# Altium schematic sheet tcrt_1.SchDoc
size A4
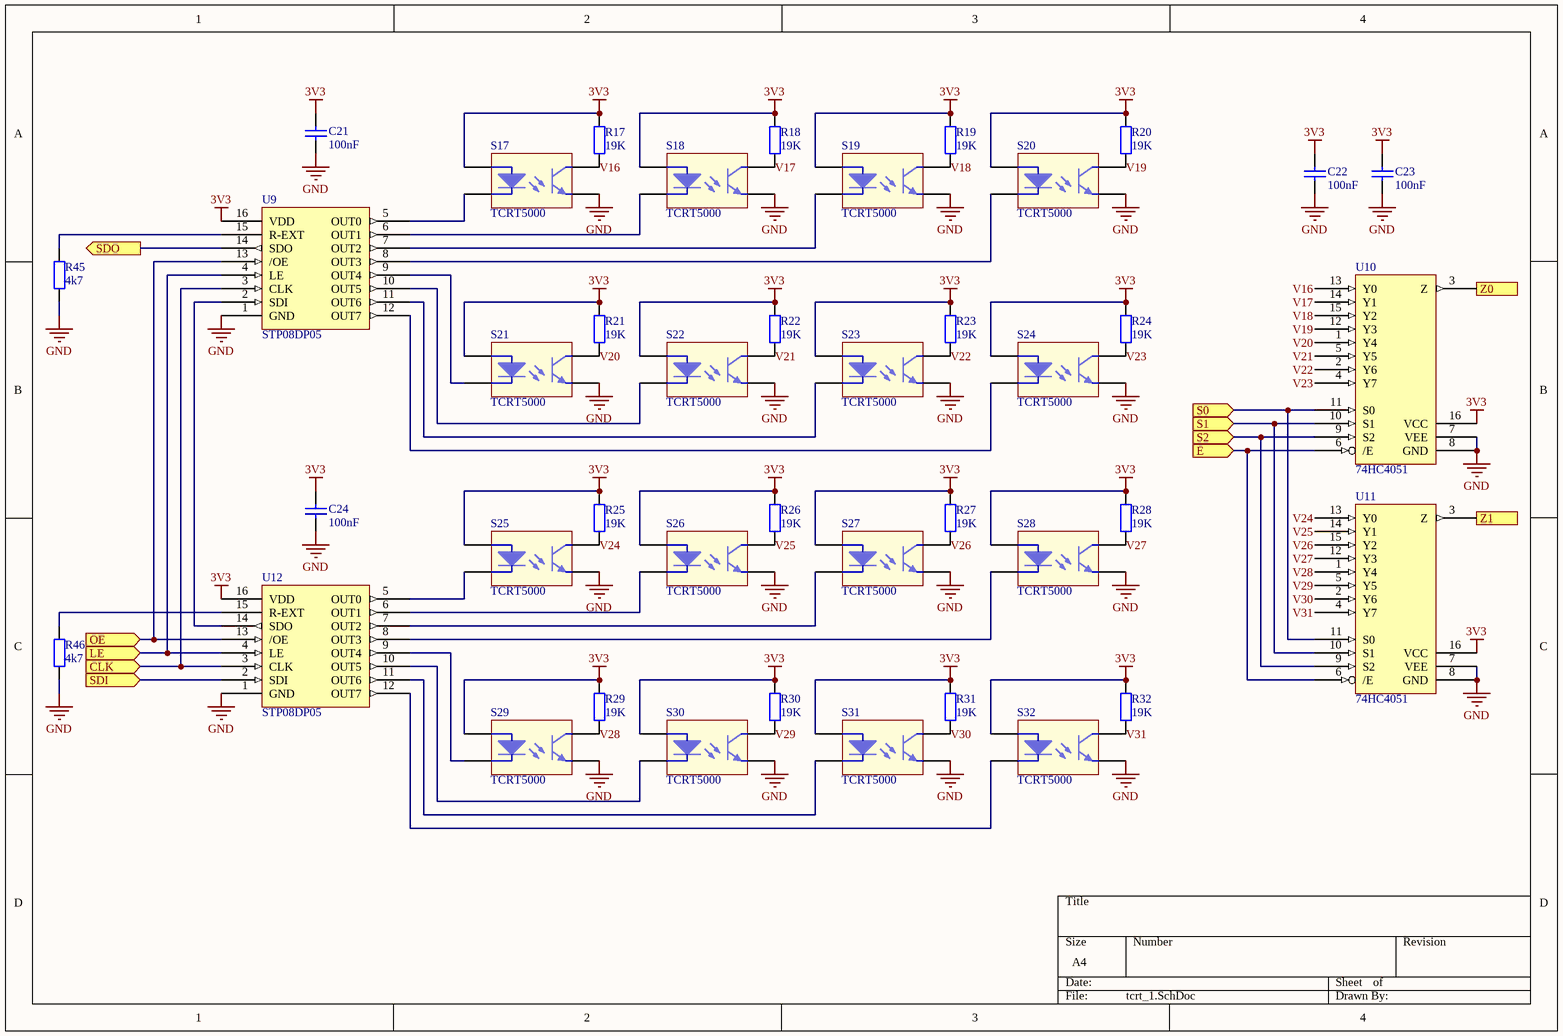
[diagram p0: tcrt_1.SchDoc]

## Parts
C21  100nF  [FP_0805_CAP_085]
C22  100nF  [FP_0805_CAP_085]
C23  100nF  [FP_0805_CAP_085]
C24  100nF  [FP_0805_CAP_085]
R17  19K  [FP_0805_RES]
R18  19K  [FP_0805_RES]
R19  19K  [FP_0805_RES]
R20  19K  [FP_0805_RES]
R21  19K  [FP_0805_RES]
R22  19K  [FP_0805_RES]
R23  19K  [FP_0805_RES]
R24  19K  [FP_0805_RES]
R25  19K  [FP_0805_RES]
R26  19K  [FP_0805_RES]
R27  19K  [FP_0805_RES]
R28  19K  [FP_0805_RES]
R29  19K  [FP_0805_RES]
R30  19K  [FP_0805_RES]
R31  19K  [FP_0805_RES]
R32  19K  [FP_0805_RES]
R45  4k7  [FP_0805_RES]
R46  4k7  [FP_0805_RES]
S17  TCRT5000  [TCRT5000_nohole]
S18  TCRT5000  [TCRT5000_nohole]
S19  TCRT5000  [TCRT5000_nohole]
S20  TCRT5000  [TCRT5000_nohole]
S21  TCRT5000  [TCRT5000_nohole]
S22  TCRT5000  [TCRT5000_nohole]
S23  TCRT5000  [TCRT5000_nohole]
S24  TCRT5000  [TCRT5000_nohole]
S25  TCRT5000  [TCRT5000_nohole]
S26  TCRT5000  [TCRT5000_nohole]
S27  TCRT5000  [TCRT5000_nohole]
S28  TCRT5000  [TCRT5000_nohole]
S29  TCRT5000  [TCRT5000_nohole]
S30  TCRT5000  [TCRT5000_nohole]
S31  TCRT5000  [TCRT5000_nohole]
S32  TCRT5000  [TCRT5000_nohole]
U9  STP08DP05  [TSSOP16_2]
U10  74HC4051  [TSSOP16_2]
U11  74HC4051  [TSSOP16_2]
U12  STP08DP05  [TSSOP16_2]

## Ports
CLK (in), E (in), LE (in), OE (in), S0 (in), S1 (in), S2 (in), SDI (in), SDO (out), Z0 (out), Z1 (out)

## Nets
3V3: C21.2 C22.2 C23.2 C24.2 R17.2 R18.2 R19.2 R20.2 R21.2 R22.2 R23.2 R24.2 R25.2 R26.2 R27.2 R28.2 R29.2 R30.2 R31.2 R32.2 S17.A S18.A S19.A S20.A S21.A S22.A S23.A S24.A S25.A S26.A S27.A S28.A S29.A S30.A S31.A S32.A U9.16(VDD) U10.16(VCC) U11.16(VCC) U12.16(VDD)
GND: C21.1 C22.1 C23.1 C24.1 R45.2 R46.2 S17.E S18.E S19.E S20.E S21.E S22.E S23.E S24.E S25.E S26.E S27.E S28.E S29.E S30.E S31.E S32.E U9.1(GND) U10.7(VEE) U10.8(GND) U11.7(VEE) U11.8(GND) U12.1(GND)
CLK: U9.3(CLK) U12.3(CLK) ; port CLK
E: U10.6(/E) U11.6(/E) ; port E
LE: U9.4(LE) U12.4(LE) ; port LE
OE: U9.13(/OE) U12.13(/OE) ; port OE
S0: U10.11(S0) U11.11(S0) ; port S0
S1: U10.10(S1) U11.10(S1) ; port S1
S2: U10.9(S2) U11.9(S2) ; port S2
SDI: U12.2(SDI) ; port SDI
SDO: U9.14(SDO) ; port SDO
V16: R17.1 S17.Coll(C) U10.13(Y0)
V17: R18.1 S18.Coll(C) U10.14(Y1)
V18: R19.1 S19.Coll(C) U10.15(Y2)
V19: R20.1 S20.Coll(C) U10.12(Y3)
V20: R21.1 S21.Coll(C) U10.1(Y4)
V21: R22.1 S22.Coll(C) U10.5(Y5)
V22: R23.1 S23.Coll(C) U10.2(Y6)
V23: R24.1 S24.Coll(C) U10.4(Y7)
V24: R25.1 S25.Coll(C) U11.13(Y0)
V25: R26.1 S26.Coll(C) U11.14(Y1)
V26: R27.1 S27.Coll(C) U11.15(Y2)
V27: R28.1 S28.Coll(C) U11.12(Y3)
V28: R29.1 S29.Coll(C) U11.1(Y4)
V29: R30.1 S30.Coll(C) U11.5(Y5)
V30: R31.1 S31.Coll(C) U11.2(Y6)
V31: R32.1 S32.Coll(C) U11.4(Y7)
Z0: U10.3(Z) ; port Z0
Z1: U11.3(Z) ; port Z1
NetR45_1: R45.1 U9.15(R-EXT)
NetR46_1: R46.1 U12.15(R-EXT)
NetS17_Cath: S17.Cath(K) U9.5(OUT0)
NetS18_Cath: S18.Cath(K) U9.6(OUT1)
NetS19_Cath: S19.Cath(K) U9.7(OUT2)
NetS20_Cath: S20.Cath(K) U9.8(OUT3)
NetS21_Cath: S21.Cath(K) U9.9(OUT4)
NetS22_Cath: S22.Cath(K) U9.10(OUT5)
NetS23_Cath: S23.Cath(K) U9.11(OUT6)
NetS24_Cath: S24.Cath(K) U9.12(OUT7)
NetS25_Cath: S25.Cath(K) U12.5(OUT0)
NetS26_Cath: S26.Cath(K) U12.6(OUT1)
NetS27_Cath: S27.Cath(K) U12.7(OUT2)
NetS28_Cath: S28.Cath(K) U12.8(OUT3)
NetS29_Cath: S29.Cath(K) U12.9(OUT4)
NetS30_Cath: S30.Cath(K) U12.10(OUT5)
NetS31_Cath: S31.Cath(K) U12.11(OUT6)
NetS32_Cath: S32.Cath(K) U12.12(OUT7)
NetU9_2: U9.2(SDI) U12.14(SDO)

## Library data of the parts
C21-C24 = CAP: Capacitor; Value: 100nF
R17-R32 R45 R46 = RES: Resistor
  R17-R32: Value: 19K
  R45 R46: Value: 4k7
S17-S32 = TCRT5000: Reflective Optical Sensor
U9 U12 = STP08DP05: LED driver [8]
U10 U11 = 74HC4051: Analog multiplexer; Reference: 2445304; Supplier: Farnell